# Altium schematic sheet host-mcu.SchDoc
size Legal; CompanyName: Brinton Engineering, LLC; Address1: 3479 Edison Way; Address2: Menlo Park CA 94025; Address3: +1 (877) 778-8435; Address4: brintonengineering.com; DocumentNumber: 6; Revision: 1; SheetNumber: 6; SheetTotal: 50
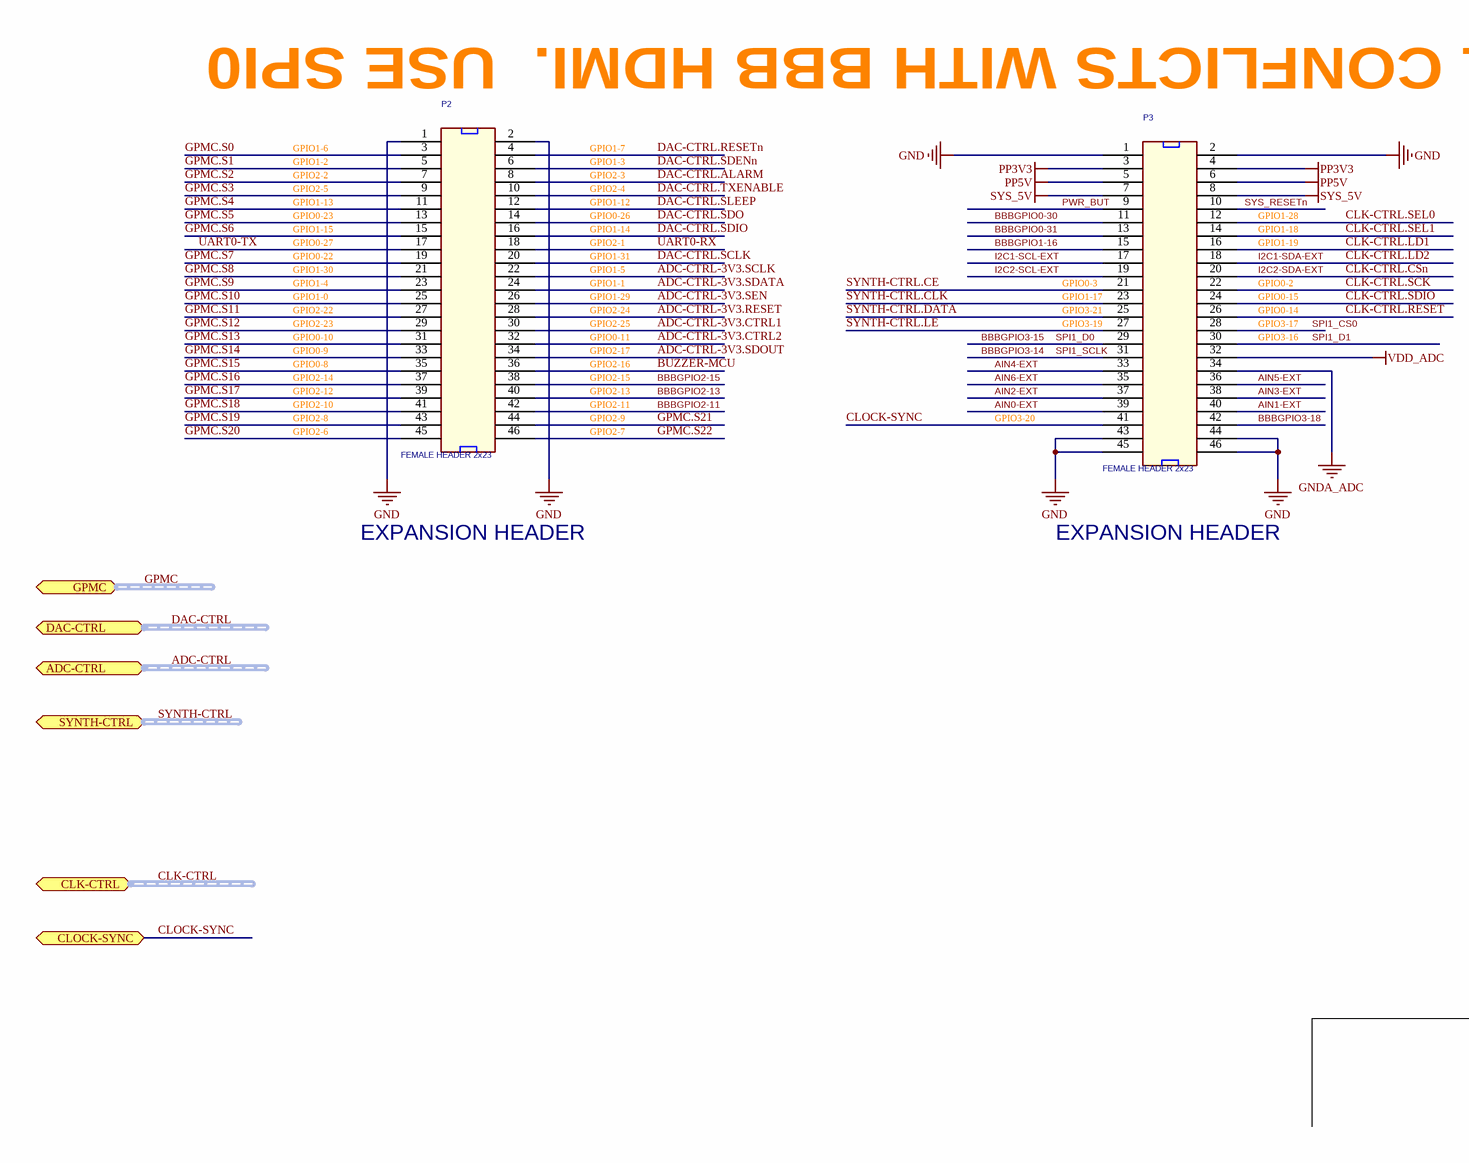
[diagram p0: host-mcu.SchDoc, left]
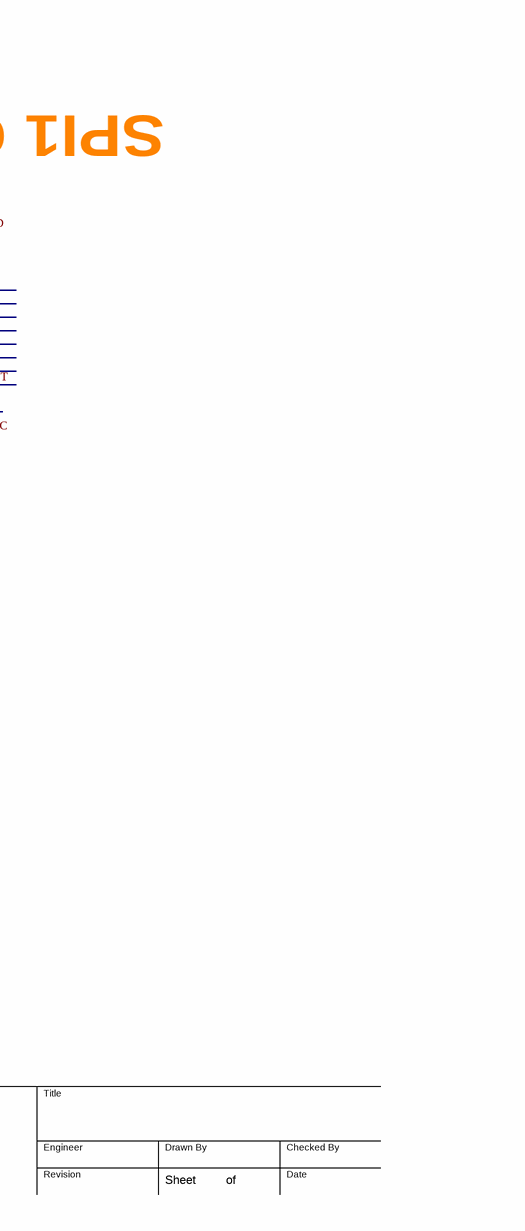
[diagram p1: host-mcu.SchDoc, right]

## Parts
P2  FEMALE HEADER 2x23  [HEADER23X2]
P3  FEMALE HEADER 2x23  [HEADER23X2]

## Ports
ADC-CTRL (harness ADC-CTRL), CLK-CTRL (harness CLK-CTRL), CLOCK-SYNC, DAC-CTRL (harness DAC-CTRL), GPMC (harness GPMC), SYNTH-CTRL (harness SYNTH-CTRL)

## Nets
GND: P2.1 P2.2 P3.1 P3.2 P3.43 P3.44 P3.45 P3.46
GNDA_ADC: P3.34
PP3V3: P3.3 P3.4
PP5V: P3.5 P3.6
SYS_5V: P3.7 P3.8
VDD_ADC: P3.32
ADC-CTRL-3V3.CTRL1: P2.30
ADC-CTRL-3V3.CTRL2: P2.32
ADC-CTRL-3V3.RESET: P2.28
ADC-CTRL-3V3.SCLK: P2.22
ADC-CTRL-3V3.SDATA: P2.24
ADC-CTRL-3V3.SDOUT: P2.34
ADC-CTRL-3V3.SEN: P2.26
AIN0-EXT: P3.39
AIN1-EXT: P3.40
AIN2-EXT: P3.37
AIN3-EXT: P3.38
AIN4-EXT: P3.33
AIN5-EXT: P3.36
AIN6-EXT: P3.35
BBBGPIO0-30: P3.11
BBBGPIO0-31: P3.13
BBBGPIO1-16: P3.15
BBBGPIO2-11: P2.42
BBBGPIO2-13: P2.40
BBBGPIO2-15: P2.38
BBBGPIO3-14: P3.31  [also labelled SPI1_SCLK]
BBBGPIO3-15: P3.29  [also labelled SPI1_D0]
BBBGPIO3-18: P3.42
BUZZER-MCU: P2.36
CLK-CTRL.CSn: P3.20  [also labelled I2C2-SDA-EXT]
CLK-CTRL.LD1: P3.16
CLK-CTRL.LD2: P3.18  [also labelled I2C1-SDA-EXT]
CLK-CTRL.RESET: P3.26
CLK-CTRL.SCK: P3.22
CLK-CTRL.SDIO: P3.24
CLK-CTRL.SEL0: P3.12
CLK-CTRL.SEL1: P3.14
CLOCK-SYNC: P3.41 ; port CLOCK-SYNC
DAC-CTRL.ALARM: P2.8
DAC-CTRL.RESETn: P2.4
DAC-CTRL.SCLK: P2.20
DAC-CTRL.SDENn: P2.6
DAC-CTRL.SDIO: P2.16
DAC-CTRL.SDO: P2.14
DAC-CTRL.SLEEP: P2.12
DAC-CTRL.TXENABLE: P2.10
GPMC.S0: P2.3
GPMC.S1: P2.5
GPMC.S2: P2.7
GPMC.S3: P2.9
GPMC.S4: P2.11
GPMC.S5: P2.13
GPMC.S6: P2.15
GPMC.S7: P2.19
GPMC.S8: P2.21
GPMC.S9: P2.23
GPMC.S10: P2.25
GPMC.S11: P2.27
GPMC.S12: P2.29
GPMC.S13: P2.31
GPMC.S14: P2.33
GPMC.S15: P2.35
GPMC.S16: P2.37
GPMC.S17: P2.39
GPMC.S18: P2.41
GPMC.S19: P2.43
GPMC.S20: P2.45
GPMC.S21: P2.44
GPMC.S22: P2.46
I2C1-SCL-EXT: P3.17
I2C2-SCL-EXT: P3.19
PWR_BUT: P3.9
SPI1_CS0: P3.28
SPI1_D1: P3.30
SYNTH-CTRL.CE: P3.21
SYNTH-CTRL.CLK: P3.23
SYNTH-CTRL.DATA: P3.25
SYNTH-CTRL.LE: P3.27
SYS_RESETn: P3.10
UART0-RX: P2.18
UART0-TX: P2.17

## Buses and harness runs
harness ADC-CTRL = port ADC-CTRL
harness CLK-CTRL = port CLK-CTRL
harness DAC-CTRL = port DAC-CTRL
harness GPMC = port GPMC
harness SYNTH-CTRL = port SYNTH-CTRL

## Notes on the sheet
- SPI1 CONFLICTS WITH BBB HDMI.  USE SPI0
- GPIO1-6
- GPIO1-2
- GPIO1-7
- GPIO1-3
- GPIO2-2
- GPIO2-5
- GPIO1-13
- GPIO0-23
- GPIO1-15
- GPIO2-3
- GPIO2-4
- GPIO1-12
- GPIO0-26
- GPIO1-14
- GPIO1-28
- GPIO1-18
- GPIO0-27
- GPIO0-22
- GPIO1-30
- GPIO1-4
- GPIO1-0
- GPIO2-1
- GPIO1-31
- GPIO1-5
- GPIO1-1
- GPIO1-29
- (near P3) GPIO0-3
- (near P3) GPIO1-17
- GPIO1-19
- GPIO0-2
- GPIO0-15
- GPIO2-22
- GPIO2-23
- GPIO0-10
- GPIO0-9
- GPIO0-8
- GPIO2-24
- GPIO2-25
- GPIO0-11
- GPIO2-17
- GPIO2-16
- (near P3) GPIO3-21
- (near P3) GPIO3-19
- GPIO0-14
- GPIO3-17
- GPIO3-16
- GPIO2-14
- GPIO2-12
- GPIO2-10
- GPIO2-8
- GPIO2-6
- GPIO2-15
- GPIO2-13
- GPIO2-11
- GPIO2-9
- GPIO2-7
- GPIO3-20
- EXPANSION HEADER
- Title
- Engineer
- Revision
- Drawn By
- Checked By
- Date
- Sheet
- of

## Library data of the parts
P2 P3 = HDR_46_F_2_0.1_0.1: CONN HEADER FMAL 46PS.1" DL GOLD; Manufacturer: Adafruit; Manufacturer P/N: 706; Number of Positions: 46; Number of Positions Loaded: All; Pitch: 0.100" (2.54mm); RoHS: RoHS Compliant; Category: Connectors, Interconnects; Stock 1: 750; Pricing 1: 1=2.75, 10=2.325, 25=2.2196, 50=2.0084, 100=1.7969, 250=1.58552, 500=1.4798, 1000=1.3741, 2500=1.32125 (USD); Connector Type: Header; Contact Type: Female Socket; Number of Rows: 2; Row Spacing: 0.100" (2.54mm); Mounting Type: Through Hole; Termination: Solder; Fastening Type: -; Features: -; Contact Finish: Gold; Contact Finish Thickness: Flash; Color: Black; Packaging: Bulk; ComponentLink1URL: http://www.sullinscorp.com/drawings/78_P(N)PxCxxxLFBN-RC,_10492-G.pdf; ComponentLink1Description: http://www.sullinscorp.com/drawings/78_P(N)PxCxxxLFBN-RC,_10492-G.pdf